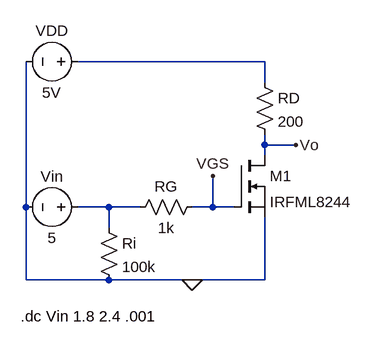
[diagram p0: schematic 3_2_b.asc]
3_2_b.asc, the LTspice schematic file:
Version 4
SHEET 1 880 680
WIRE 384 -64 96 -64
WIRE 384 -32 384 -64
WIRE 384 64 384 48
WIRE 432 64 384 64
WIRE 384 80 384 64
WIRE 16 160 16 -64
WIRE 144 160 96 160
WIRE 192 160 144 160
WIRE 304 160 304 112
WIRE 304 160 272 160
WIRE 336 160 304 160
WIRE 144 192 144 160
WIRE 16 272 16 160
WIRE 144 272 16 272
WIRE 272 272 144 272
WIRE 384 272 384 176
WIRE 384 272 272 272
FLAG 272 272 0
FLAG 304 112 VGS
FLAG 432 64 Vo
SYMBOL voltage 112 160 R90
WINDOW 0 -32 56 VBottom 2
WINDOW 3 32 56 VTop 2
SYMATTR InstName Vin
SYMATTR Value 5
SYMBOL res 128 176 R0
SYMATTR InstName Ri
SYMATTR Value 100k
SYMBOL res 288 144 R90
WINDOW 0 0 56 VBottom 2
WINDOW 3 32 56 VTop 2
SYMATTR InstName RG
SYMATTR Value 1k
SYMBOL res 368 -48 R0
SYMATTR InstName RD
SYMATTR Value 200
SYMBOL voltage 112 -64 R90
WINDOW 0 -32 56 VBottom 2
WINDOW 3 32 56 VTop 2
SYMATTR InstName VDD
SYMATTR Value 5V
SYMBOL nmos 336 80 R0
SYMATTR InstName M1
SYMATTR Value IRFML8244
TEXT 8 328 Left 2 !.dc Vin 1.8 2.4 .001

The netlist it stands for:
* 3_2_b.asc
Vin N002 0 5
Ri N002 0 100k
RG VGS N002 1k
RD N001 Vo 200
VDD N001 0 5V
M1 Vo VGS 0 0 IRFML8244
.model NMOS NMOS
.model PMOS PMOS
.lib standard.mos
.dc Vin 1.8 2.4 .001
.backanno
.end